# EAGLE design AmpPCB (EAGLE 9.5.1)
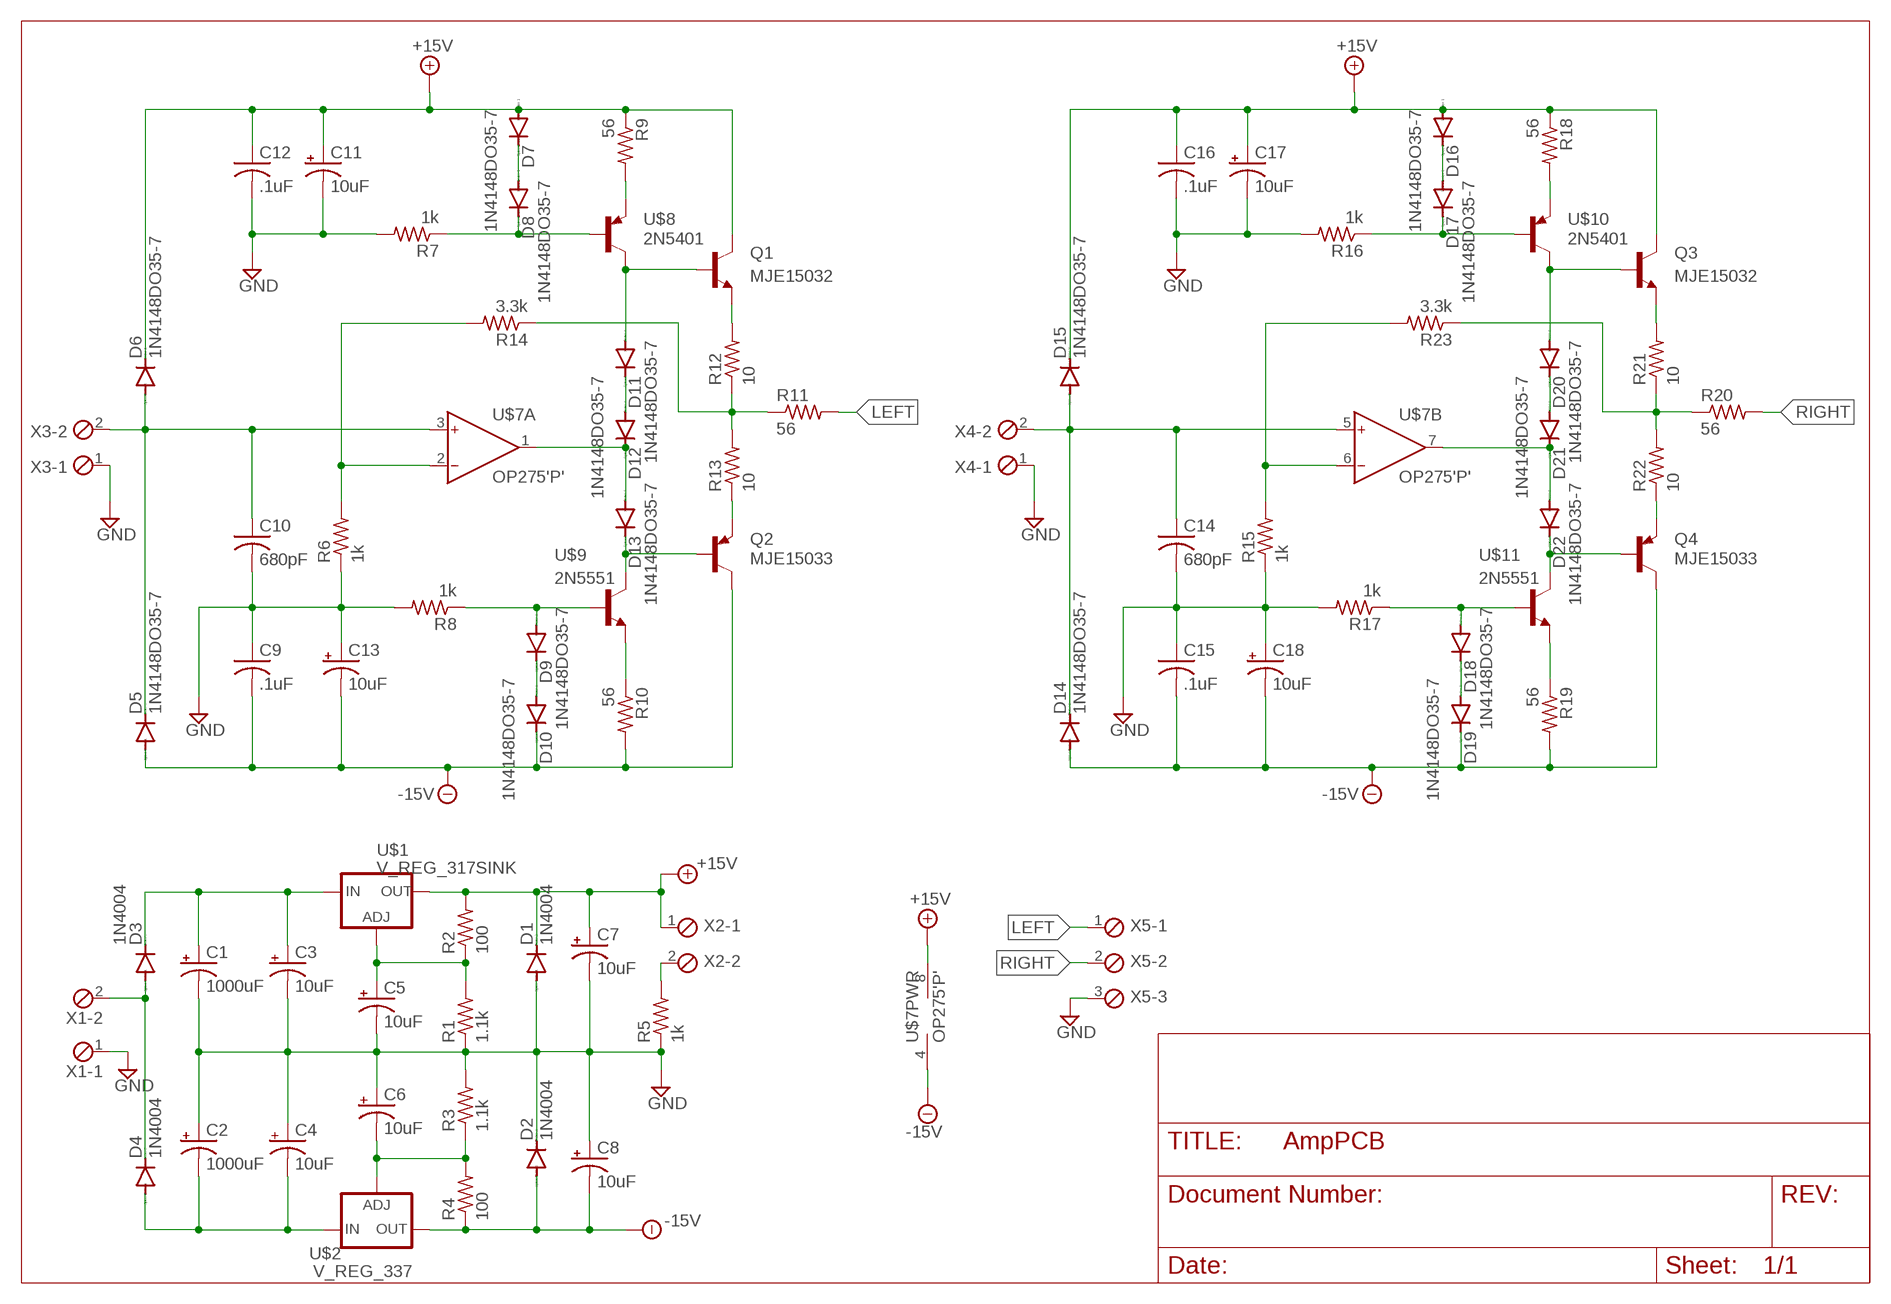
[diagram p0: schematic, sheet 1]

## Parts
C1  1000uF  CPOL-USTT5D10  [TT5D10]
C2  1000uF  CPOL-USTT5D10  [TT5D10]
C3  10uF  CPOL-USE2-5  [E2-5]
C4  10uF  CPOL-USE2-5  [E2-5]
C5  10uF  CPOL-USE2-5  [E2-5]
C6  10uF  CPOL-USE2-5  [E2-5]
C7  10uF  CPOL-USE2-5  [E2-5]
C8  10uF  CPOL-USE2-5  [E2-5]
C9  .1uF  C-US102-064X133  [C102-064X133]
C10  680pF  C-US075-042X103  [C075-042X103]
C11  10uF  CPOL-USE2-5  [E2-5]
C12  .1uF  C-US102-064X133  [C102-064X133]
C13  10uF  CPOL-USE2-5  [E2-5]
C14  680pF  C-US075-042X103  [C075-042X103]
C15  .1uF  C-US102-064X133  [C102-064X133]
C16  .1uF  C-US102-064X133  [C102-064X133]
C17  10uF  CPOL-USE2-5  [E2-5]
C18  10uF  CPOL-USE2-5  [E2-5]
D1  1N4004  [DO41-10]
D2  1N4004  [DO41-10]
D3  1N4004  [DO41-10]
D4  1N4004  [DO41-10]
D5  1N4148DO35-7  [DO35-7]
D6  1N4148DO35-7  [DO35-7]
D7  1N4148DO35-7  [DO35-7]
D8  1N4148DO35-7  [DO35-7]
D9  1N4148DO35-7  [DO35-7]
D10  1N4148DO35-7  [DO35-7]
D11  1N4148DO35-7  [DO35-7]
D12  1N4148DO35-7  [DO35-7]
D13  1N4148DO35-7  [DO35-7]
D14  1N4148DO35-7  [DO35-7]
D15  1N4148DO35-7  [DO35-7]
D16  1N4148DO35-7  [DO35-7]
D17  1N4148DO35-7  [DO35-7]
D18  1N4148DO35-7  [DO35-7]
D19  1N4148DO35-7  [DO35-7]
D20  1N4148DO35-7  [DO35-7]
D21  1N4148DO35-7  [DO35-7]
D22  1N4148DO35-7  [DO35-7]
Q1  MJE15032  [TO220V]
Q2  MJE15033  [TO220V]
Q3  MJE15032  [TO220V]
Q4  MJE15033  [TO220V]
R1  1.1k  R-US_0207/10  [0207/10]
R2  100  R-US_0207/10  [0207/10]
R3  1.1k  R-US_0207/10  [0207/10]
R4  100  R-US_0207/10  [0207/10]
R5  1k  R-US_0207/10  [0207/10]
R6  1k  R-US_0207/10  [0207/10]
R7  1k  R-US_0207/10  [0207/10]
R8  1k  R-US_0207/10  [0207/10]
R9  56  R-US_0207/10  [0207/10]
R10  56  R-US_0207/10  [0207/10]
R11  56  R-US_0207/10  [0207/10]
R12  10  R-US_0207/10  [0207/10]
R13  10  R-US_0207/10  [0207/10]
R14  3.3k  R-US_0207/10  [0207/10]
R15  1k  R-US_0207/10  [0207/10]
R16  1k  R-US_0207/10  [0207/10]
R17  1k  R-US_0207/10  [0207/10]
R18  56  R-US_0207/10  [0207/10]
R19  56  R-US_0207/10  [0207/10]
R20  56  R-US_0207/10  [0207/10]
R21  10  R-US_0207/10  [0207/10]
R22  10  R-US_0207/10  [0207/10]
R23  3.3k  R-US_0207/10  [0207/10]
U$1  V_REG_317SINK  [TO220-ADJ]
U$2  V_REG_337  [TO220-ADJ-NEG]
U$7  OP275'P'  [DIL08]
U$8  2N5401  [2N5401]
U$9  2N5551  [2N5551]
U$10  2N5401  [2N5401]
U$11  2N5551  [2N5551]
X1  MPT2  [2POL254]
X2  MPT2  [2POL254]
X3  MPT2  [2POL254]
X4  MPT2  [2POL254]
X5  MPT3  [3POL254]

## Nets
+15V [Supply]: C7.+ C11.+ C12.1 C16.1 C17.+ D1.C D6.C D7.A D15.C D16.A Q1.2(C) Q3.2(C) R2.2 R9.1 R18.1 U$1.OUT U$7.8(PWR:V+) X2.1
-15V [Supply]: C8.- C9.2 C13.- C15.2 C18.- D2.A D5.A D10.C D14.A D19.C Q2.2(C) Q4.2(C) R4.1 R10.2 R19.2 U$2.OUT U$7.4(PWR:V-)
GND: C1.- C2.+ C3.- C4.+ C5.- C6.+ C7.- C8.+ C9.1 C10.2 C11.- C12.2 C13.+ C14.2 C15.1 C16.2 C17.- C18.+ D1.A D2.C R1.1 R3.2 R5.1 R6.1 R7.2 R8.2 R15.1 R16.2 R17.2 X1.1 X3.1 X4.1 X5.3
LEFT: R11.2 X5.1
N$1 [Power]: C1.+ C3.+ D3.C U$1.IN
N$2: C10.1 D5.C D6.A U$7.3(A:IN+) X3.2
N$3 [Supply]: C5.+ R1.2 R2.1 U$1.ADJ
N$4: R10.1 U$9.E
N$5 [Power]: D3.A D4.C X1.2
N$6 [Supply]: C6.- R3.1 R4.2 U$2.ADJ
N$7 [Power]: C2.- C4.- D4.A U$2.IN
N$8: D9.A R8.1 U$9.B
N$9: R5.2 X2.2
N$10: D9.C D10.A
N$11: R6.2 R14.2 U$7.2(A:IN-)
N$12: D13.C Q2.1(B) U$9.C
N$13: D12.C D13.A U$7.1(A:OUT)
N$14: D11.C D12.A
N$15: Q1.3(E) R12.2
N$16: Q2.3(E) R13.1
N$17: R11.1 R12.1 R13.2 R14.1
N$18: D11.A Q1.1(B) U$8.C
N$19: D8.C R7.1 U$8.B
N$20: D7.C D8.A
N$21: R9.2 U$8.E
N$22: D18.A R17.1 U$11.B
N$23: D18.C D19.A
N$24: R15.2 R23.2 U$7.6(B:IN-)
N$25: C14.1 D14.C D15.A U$7.5(B:IN+) X4.2
N$26: R19.1 U$11.E
N$27: D22.C Q4.1(B) U$11.C
N$28: D21.C D22.A U$7.7(B:OUT)
N$29: D20.C D21.A
N$30: Q4.3(E) R22.1
N$31: R20.1 R21.1 R22.2 R23.1
N$32: Q3.3(E) R21.2
N$33: D20.A Q3.1(B) U$10.C
N$34: D17.C R16.1 U$10.B
N$35: D16.C D17.A
N$36: R18.2 U$10.E
RIGHT: R20.2 X5.2

## Library data of the parts
C1-C8 C11 C13 C17 C18 = rcl:CPOL-US: POLARIZED CAPACITOR, American symbol; SPICEPREFIX: C
C9 C10 C12 C14-C16 = rcl:C-US: CAPACITOR, American symbol; SPICEPREFIX: C
D1-D4 = diode:1N4004: DIODE general purpose rectifier, 1 A
D5-D22 = diode:1N4148: DIODE high speed (Philips)
Q1 Q3 = engr301-proj-new :MJE15032: NPN Power Transistor HF Audio Driver 8.0A, 250V, 50W
Q2 Q4 = engr301-proj-new :MJE15033: PNP Power Transistor HF Audio Driver 8.0A, 250V, 50W
R1-R23 = rcl:R-US_: RESISTOR, American symbol; SPICEPREFIX: R
U$1 = engr301-proj-new :V_REG_317: Voltage Regulator Standard LM317 adjustable voltage regulator. AOI (Adjust Output Input). Google 'LM317 Calculator' for easy to use app to get the two resistor values needed. 240/720 for 5V output. 240/390 for 3.3V output. Spark Fun Electronics SKU : COM-00527
U$2 = engr301-proj-new :V_REG_337: LM-337 Negative Adjustable Voltage Regulator
U$7 = engr301-proj-new :OP275: OP275 - Dual Bipolar/JFET Audio Op-amp
U$8 U$10 = engr301-proj-new :2N5401: PNP Amplifier Transistors
U$9 U$11 = engr301-proj-new :2N5551: NPN Amplifier Transistors
X1-X4 = con-phoenix-254:MPT2: PHOENIX CONNECTOR; OC_FARNELL: unknown; OC_NEWARK: unknown
X5 = con-phoenix-254:MPT3: PHOENIX CONNECTOR; OC_FARNELL: unknown; OC_NEWARK: unknown

## Net classes
1 Supply: width 0.61 mm, drill 0.61 mm, clearance 0.381 mm to class 0, clearance 0.381 mm
2 Power: width 0.914 mm, drill 0.914 mm, clearance 0.381 mm to class 0, clearance 0.381 mm to class 1, clearance 0.381 mm

## Board
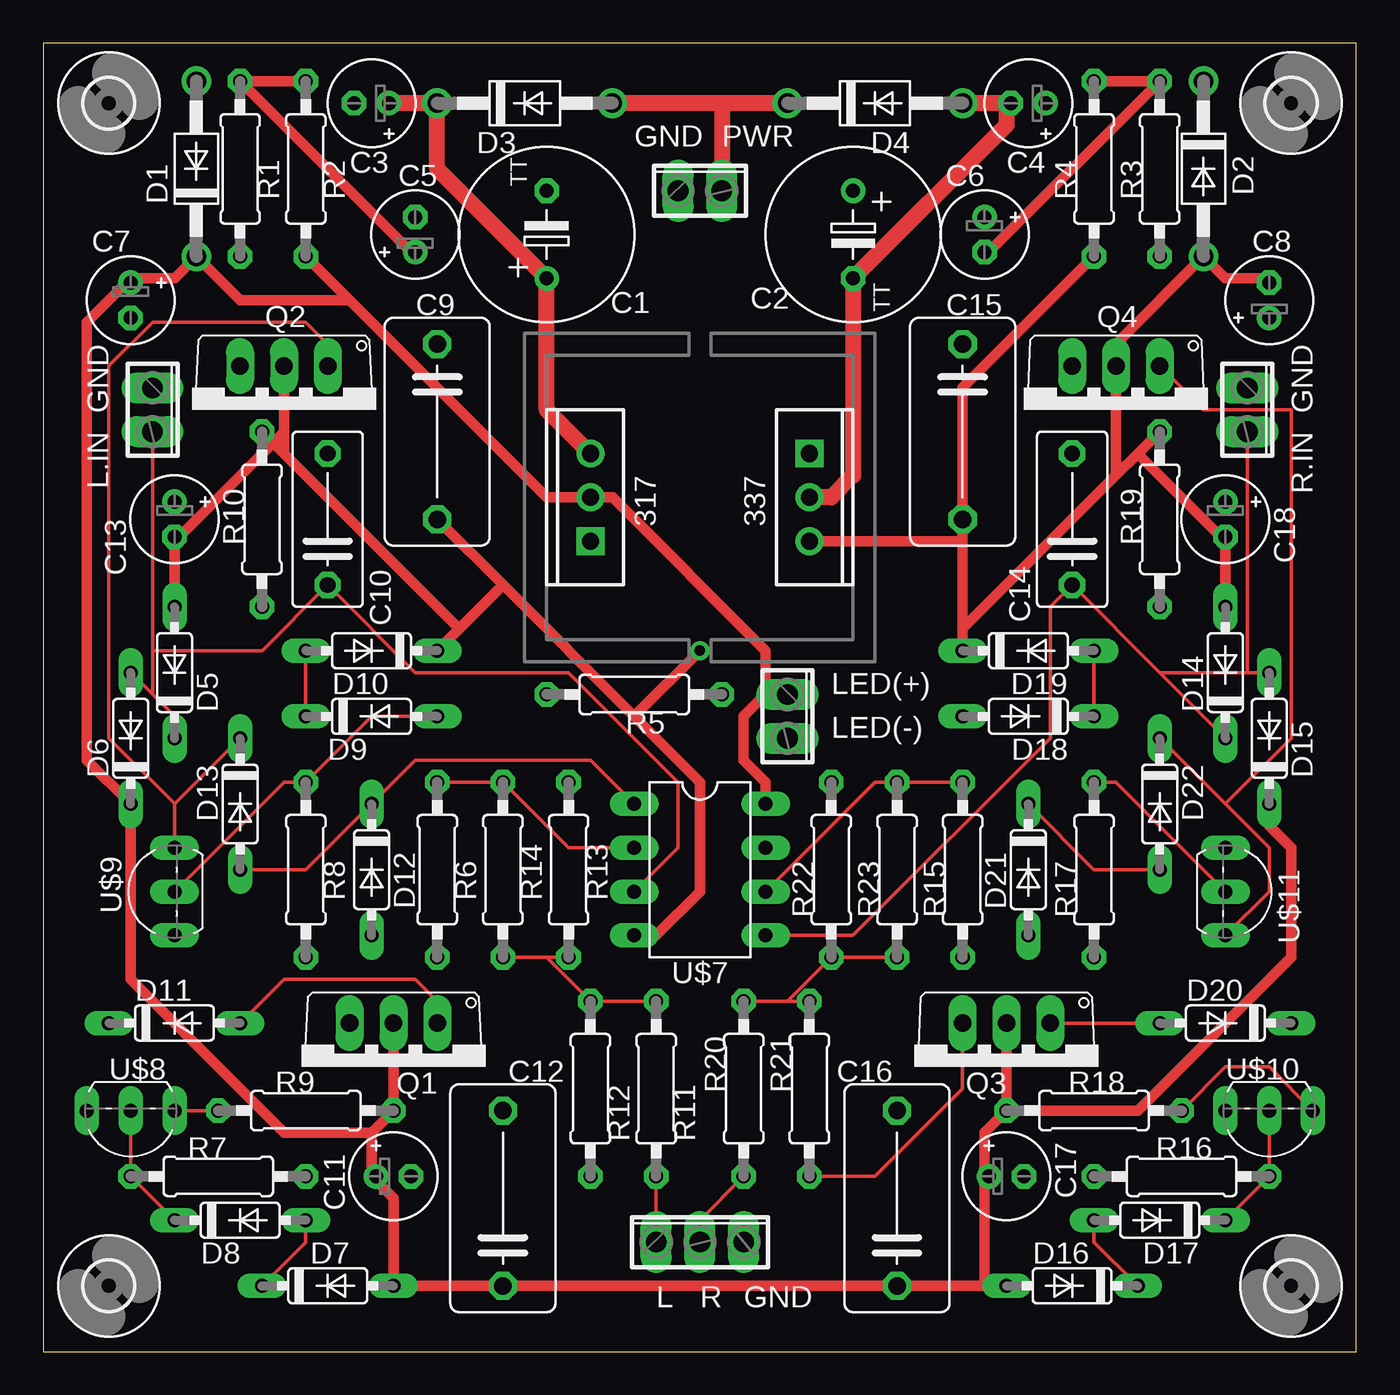
[diagram p1: board, top side]
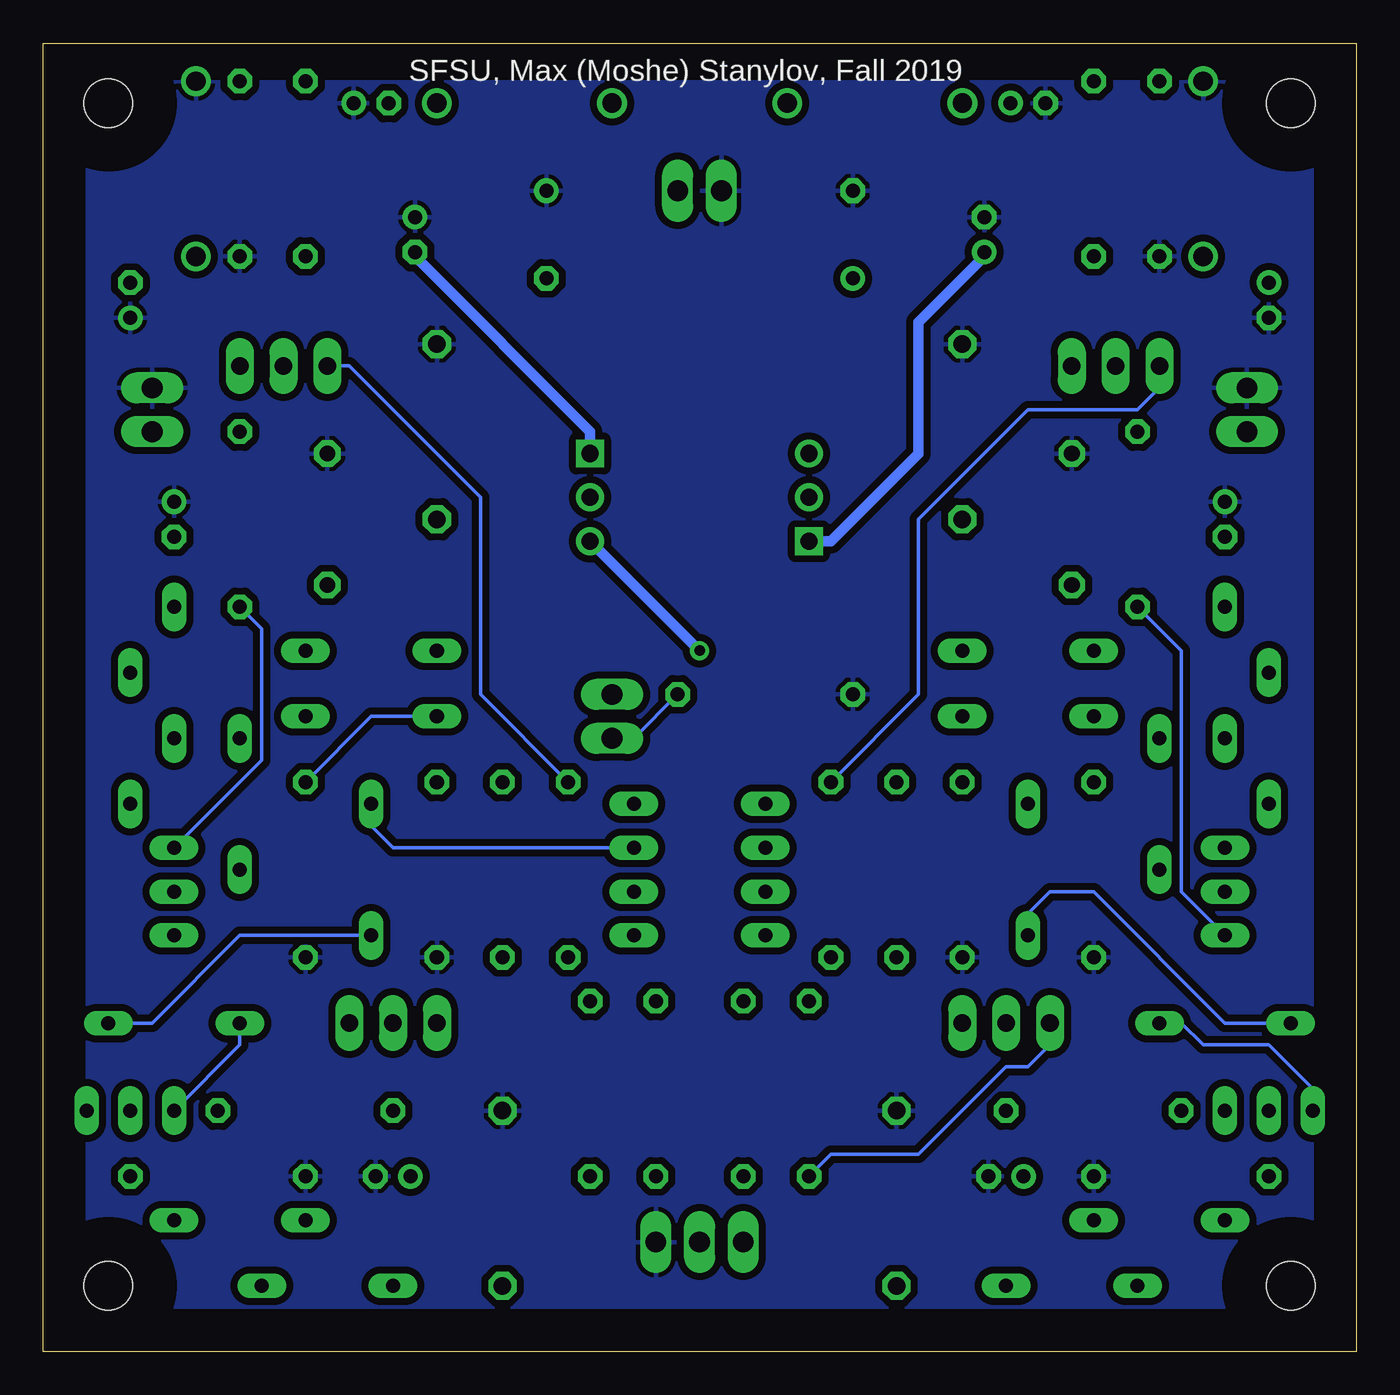
[diagram p2: board, bottom side, seen from below]

Size 76.18 x 75.87 mm. Coordinates in mm from the lower left corner, seen from the top.
Outline: 0,0 76.18,0 76.18,75.87 0,75.87 0,0
Copper layers (1*16): Top 0.035mm / dielectric 1.5mm / Bottom 0.035mm
Design rules "engr301_new": minimum track width 8mil, minimum drill 20mil, track to track 8mil, track to pad 10mil, pad to pad 10mil, via to via 10mil, smd to smd 8mil, copper to edge 15mil, drill to drill 8mil, minimum pad ring 12mil, minimum via ring 10mil, stop-mask expansion 4mil, vias tented up to drill 25mil, thermal gap 10mil

### Footprints (pad centres in the part's own frame; a part is rotated, then mirrored left to right if it is on the bottom)
TT5D10 = drill 0.813: + -2.54,0 | drill 0.813 octagon: - 2.54,0
E2-5 = drill 0.813 pad 1.27: + -1.016,0 | drill 0.813 pad 1.27 octagon: - 1.016,0
C102-064X133 = drill 1.016 octagon: 1 -5.08,0; 2 5.08,0
C075-042X103 = drill 0.914 octagon: 1 -3.81,0; 2 3.81,0
DO41-10 = drill 1.118: A 5.08,0; C -5.08,0
DO35-7 = drill 0.813 long: A 3.81,0; C -3.81,0
TO220V = drill 1.016 long: 1 -2.54,-2.54; 2 0,-2.54; 3 2.54,-2.54
0207/10 = drill 0.813 octagon: 1 -5.08,0; 2 5.08,0
TO220-ADJ = drill 1 square: ADJ -2.54,0 | drill 1: IN 2.54,0; OUT 0,0
TO220-ADJ-NEG = drill 1 square: ADJ -2.54,0 | drill 1: IN 0,0; OUT 2.54,0
2,8 = hole 2.8: 0,0
DIL08 = drill 0.813 long: 1 -3.81,-3.81; 2 -1.27,-3.81; 3 1.27,-3.81; 4 3.81,-3.81; 5 3.81,3.81; 6 1.27,3.81; 7 -1.27,3.81; 8 -3.81,3.81
2N5401 = drill 0.813 long: B 0,0; C 2.54,0; E -2.54,0
2N5551 = drill 0.813 long: B 0,0; C 2.54,0; E -2.54,0
2POL254 = drill 1.2 long: 1 -1.27,0; 2 1.27,0
3POL254 = drill 1.2 long: 1 -2.54,0; 2 0,0; 3 2.54,0

### Placement (x,y rotation side)
C1  29.21,64.77 90 top
C2  46.99,64.77 270 top
C3  19.05,72.39 180 top
C4  57.15,72.39 180 top
C5  21.59,64.77 90 top
C6  54.61,64.77 270 top
C7  5.08,60.96 270 top
C8  71.12,60.96 90 top
C9  22.86,53.34 270 top
C10  16.51,48.26 90 top
C11  20.32,10.16 0 top
C12  26.67,8.89 90 top
C13  7.62,48.26 270 top
C14  59.69,48.26 90 top
C15  53.34,53.34 270 top
C16  49.53,8.89 90 top
C17  55.88,10.16 0 top
C18  68.58,48.26 270 top
D1  8.89,68.58 90 top
D2  67.31,68.58 270 top
D3  27.94,72.39 0 top
D4  48.26,72.39 0 top
D5  7.62,39.37 90 top
D6  5.08,35.56 90 top
D7  16.51,3.81 0 top
D8  11.43,7.62 0 top
D9  19.05,36.83 0 top
D10  19.05,40.64 180 top
D11  7.62,19.05 0 top
D12  19.05,27.94 270 top
D13  11.43,31.75 270 top
D14  68.58,39.37 90 top
D15  71.12,35.56 90 top
D16  59.69,3.81 180 top
D17  64.77,7.62 180 top
D18  57.15,36.83 180 top
D19  57.15,40.64 0 top
D20  68.58,19.05 180 top
D21  57.15,27.94 270 top
D22  64.77,31.75 270 top
Q1  20.32,16.51 180 top
Q2  13.97,54.61 180 top
Q3  55.88,16.51 180 top
Q4  62.23,54.61 180 top
R1  11.43,68.58 90 top
R2  15.24,68.58 270 top
R3  64.77,68.58 270 top
R4  60.96,68.58 90 top
R5  34.29,38.1 0 top
R6  22.86,27.94 90 top
R7  10.16,10.16 0 top
R8  15.24,27.94 270 top
R9  15.24,13.97 180 top
R10  12.7,48.26 90 top
R11  35.56,15.24 270 top
R12  31.75,15.24 270 top
R13  30.48,27.94 270 top
R14  26.67,27.94 90 top
R15  53.34,27.94 90 top
R16  66.04,10.16 180 top
R17  60.96,27.94 270 top
R18  60.96,13.97 0 top
R19  64.77,48.26 90 top
R20  40.64,15.24 270 top
R21  44.45,15.24 270 top
R22  45.72,27.94 270 top
R23  49.53,27.94 90 top
U$1  31.75,49.53 90 top
U$2  44.45,49.53 270 top
U$3  [2,8]  3.81,72.39 0 top
U$4  [2,8]  72.39,72.39 0 top
U$5  [2,8]  72.39,3.81 0 top
U$6  [2,8]  3.81,3.81 0 top
U$7  38.1,27.94 270 top
U$8  5.08,13.97 180 top
U$9  7.62,26.67 90 top
U$10  71.12,13.97 180 top
U$11  68.58,26.67 270 top
X1  38.1,67.31 0 top
X2  43.18,36.83 270 top
X3  6.35,54.61 270 top
X4  69.85,54.61 270 top
X5  38.1,6.35 0 top

### Tracks (layer width: path | path; a pad name or v marks a point on that pad's centre or on a via)
+15V
  Top 0.61: U$7.8 41.91,33.02 40.64,34.29 40.64,36.83 41.91,38.1 | 5.08,62.23 7.62,62.23 D1.C 11.43,60.96 17.78,60.96 | 17.78,60.96 29.21,49.53 U$1.OUT 33.02,49.53 41.91,40.64 41.91,38.1 | 17.78,60.96 R2.2 | 41.91,38.1 X2.1 | 19.05,12.7 19.05,10.16 | 19.05,12.7 R9.1 Q1.2 | 19.05,12.7 13.97,12.7 5.08,21.59 D6.C 2.54,34.29 2.54,59.69 5.08,62.23 | 19.05,10.16 20.32,8.89 D7.A C12.1 C16.1 54.61,3.81 | 19.05,10.16 C11.+ | 54.61,10.16 54.61,12.7 R18.1 | D15.C 71.12,30.48 72.39,29.21 72.39,22.86 63.5,13.97 R18.1 | R18.1 Q3.2 | 54.61,10.16 54.61,3.81 | 54.61,3.81 D16.A | 54.61,10.16 C17.+ | 5.08,62.23 C7.+
-15V  (via drill 0.61)
  Top 0.61: C8.- 71.12,62.23 68.58,62.23 D2.A 62.23,58.42 Q4.2 62.23,50.8 | 68.58,46.99 D14.A | 53.34,46.99 C15.2 53.34,55.88 R4.1 | 53.34,46.99 53.34,41.91 | 53.34,41.91 D19.C | 53.34,41.91 62.23,50.8 | 62.23,50.8 63.5,52.07 | 63.5,52.07 R19.2 | 53.34,46.99 U$2.OUT | 63.5,52.07 68.58,46.99 | 68.58,46.99 C18.- | 7.62,46.99 D5.A | U$7.4 35.56,24.13 38.1,26.67 38.1,33.02 34.29,36.83 | C9.2 26.67,44.45 | 26.67,44.45 34.29,36.83 | 26.67,44.45 24.13,41.91 | 24.13,41.91 D10.C | 24.13,41.91 13.97,52.07 | 13.97,52.07 R10.2 | 13.97,52.07 13.97,53.34 | 13.97,53.34 Q2.2 | 13.97,53.34 7.62,46.99 | 7.62,46.99 C13.- | 34.29,36.83 v38.1,40.64
  Bottom 0.61: v38.1,40.64 U$2.OUT
GND
  pour Bottom (isolate 0.406): 73.66,73.66 5.08,73.66 arc90 2.54,71.12 2.54,2.54 73.66,2.54
LEFT
  Top 0.203: X5.1 R11.2
N$1
  Top 0.914: C3.+ D3.C 22.86,68.58 C1.+ 29.21,54.61 U$1.IN
N$2
  Top 0.203: 6.35,38.1 7.62,36.83 D5.C | 6.35,38.1 D6.A | 6.35,38.1 6.35,40.64 | 6.35,40.64 X3.2 | U$7.3 36.83,29.21 36.83,33.02 30.48,39.37 21.59,39.37 C10.1 12.7,40.64 6.35,40.64
N$3
  Top 0.61: R2.1 R1.2 21.59,63.5 C5.+
  Bottom 0.61: U$1.ADJ 30.48,46.99 25.4,52.07 25.4,59.69 21.59,63.5 C5.+
N$4
  Bottom 0.203: U$9.E 10.16,26.67 10.16,40.64 R10.1
N$5
  Top 0.914: D4.C 39.37,72.39 | 39.37,72.39 D3.A | 39.37,72.39 X1.2
N$6
  Top 0.61: C6.- 54.61,63.5 R3.1 R4.2
  Bottom 0.61: U$2.ADJ 44.45,53.34 54.61,63.5 C6.-
N$7
  Top 0.914: 55.88,72.39 55.88,71.12 C2.- 46.99,50.8 45.72,49.53 U$2.IN | 55.88,72.39 D4.A | 55.88,72.39 C4.-
N$8
  Top 0.203: U$9.B 13.97,33.02 R8.1 19.05,36.83 D9.A
N$9
  Bottom 0.203: R5.2 41.91,35.56 X2.2
N$10
  Top 0.203: D10.A D9.C
N$11
  Top 0.203: R6.2 R14.2 30.48,29.21 U$7.2
N$12
  Top 0.203: 7.62,31.75 U$9.C | D13.C 7.62,31.75 | Q2.1 16.51,58.42 15.24,59.69 6.35,59.69 3.81,57.15 3.81,35.56 7.62,31.75
N$13
  Top 0.203: D13.A 15.24,27.94 D12.C 21.59,34.29 31.75,34.29 U$7.1
N$14
  Bottom 0.203: D11.C 7.62,19.05 15.24,26.67 17.78,26.67 19.05,25.4 D12.A
N$15
  Bottom 0.203: R12.2 30.48,11.43 25.4,11.43 20.32,16.51 19.05,16.51 17.78,17.78 Q1.3
N$16
  Bottom 0.203: R13.1 25.4,38.1 25.4,48.26 19.05,54.61 12.7,54.61 11.43,55.88 Q2.3
N$17
  Top 0.203: R13.2 29.21,22.86 | 29.21,22.86 R14.1 | 29.21,22.86 R12.1 R11.1
N$18
  Top 0.203: Q1.1 22.86,20.32 21.59,21.59 13.97,21.59 D11.A
  Bottom 0.203: U$8.C 2.54,15.24 5.08,17.78 8.89,17.78 10.16,19.05 D11.A
N$19
  Top 0.203: D8.C R7.1 U$8.B
N$20
  Top 0.203: D7.C 15.24,6.35 D8.A
N$21
  Top 0.203: R9.2 U$8.E
N$22
  Top 0.203: U$11.B 62.23,33.02 R17.1
  Bottom 0.203: D18.A 57.15,36.83 R17.1
N$23
  Top 0.203: D19.A D18.C
N$24
  Top 0.203: U$7.6 48.26,33.02 R23.2 R15.2
N$25
  Top 0.203: U$7.5 46.99,24.13 58.42,35.56 58.42,43.18 C14.1 64.77,39.37 | 64.77,39.37 D14.C | 64.77,39.37 69.85,39.37 | 69.85,39.37 D15.A | 69.85,39.37 X4.2
N$26
  Bottom 0.203: U$11.E 63.5,34.29 63.5,41.91 R19.1
N$27
  Top 0.203: U$11.C 71.12,26.67 71.12,29.21 68.58,31.75 | D22.C 68.58,31.75 | Q4.1 67.31,54.61 72.39,54.61 72.39,35.56 68.58,31.75
N$28
  Top 0.203: D22.A 60.96,27.94 D21.C
  Bottom 0.203: U$7.7 55.88,29.21 57.15,30.48 D21.C
N$29
  Bottom 0.203: D21.A 64.77,24.13 69.85,19.05 D20.C
N$30
  Bottom 0.203: R22.1 50.8,38.1 50.8,49.53 58.42,57.15 Q4.3
N$31
  Top 0.203: R21.1 43.18,20.32 | 43.18,20.32 R20.1 | 43.18,20.32 R22.2 R23.1
N$32
  Top 0.203: R21.2 48.26,10.16 53.34,15.24 Q3.3
N$33
  Top 0.203: Q3.1 D20.A
  Bottom 0.203: U$10.C 64.77,17.78 D20.A
N$34
  Top 0.203: D17.C R16.1 U$10.B
N$35
  Top 0.203: D16.C 60.96,6.35 D17.A
N$36
  Top 0.203: R18.2 68.58,16.51 71.12,16.51 U$10.E
RIGHT
  Top 0.203: R20.2 38.1,7.62 X5.2

### Text on the board
tPlace: GND | PWR | GND | GND | L.IN | R.IN | 317 | 337 | LED(+) | LED(-) | L | R | GND
bPlace: SFSU, Max (Moshe) Stanylov, Fall 2019